# EAGLE design trackuino-simple (EAGLE 6.3)
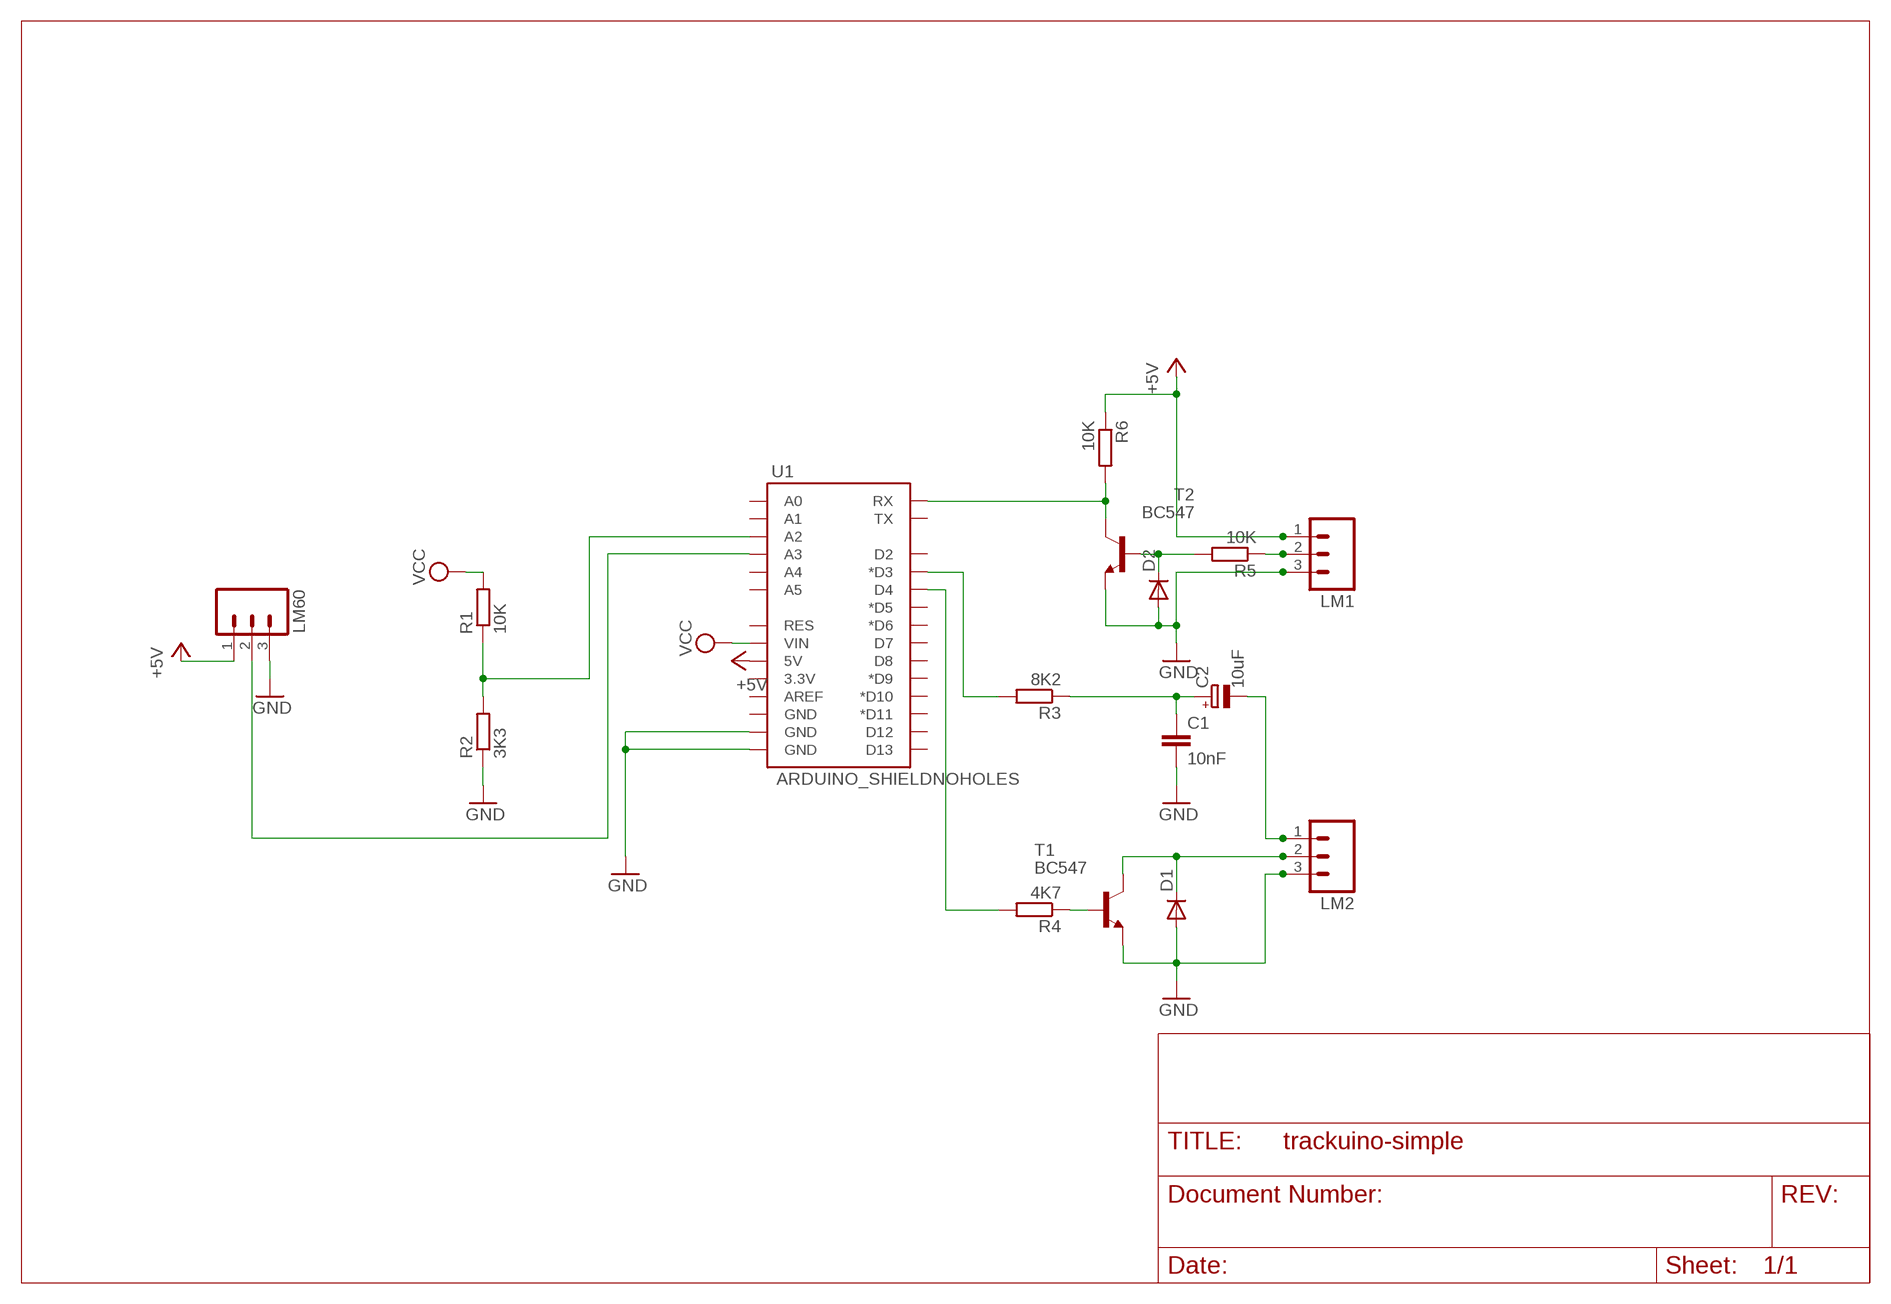
[diagram p0: schematic, sheet 1]

## Parts
C1  10nF  C-EU050-025X075  [C050-025X075]
C2  10uF  CPOL-EUE2.5-6  [E2,5-6]
D1  DIODE-DO41-10  [DO41-10]
D2  DIODE-DO41-10  [DO41-10]
LM1  M03PTH  [1X03]
LM2  M03PTH  [1X03]
LM60  M03PTH  [1X03]
R1  10K  R-EU_0207/10  [0207/10]
R2  3K3  R-EU_0207/10  [0207/10]
R3  8K2  R-EU_0207/10  [0207/10]
R4  4K7  R-EU_0207/10  [0207/10]
R5  10K  R-EU_0207/10  [0207/10]
R6  10K  R-EU_0207/10  [0207/10]
T1  BC547  [TO92]
T2  BC547  [TO92]
U1  ARDUINO_SHIELDNOHOLES  [DUEMILANOVE_SHIELD_NOHOLES]

## Nets
+5V: LM1.1 LM60.1 R6.1 U1.5V
A0: R1.1 R2.2 U1.A2
GND: C1.2 D1.A D2.A LM1.3 LM2.3 LM60.3 R2.1 T1.1(E) T2.1(E) U1.GND@0(GND) U1.GND@1(GND)
N$1: R6.2 T2.3(C) U1.RX
N$2: LM60.2 U1.A3
N$3: R4.2 U1.D4
N$4: R4.1 T1.2(B)
N$5: D2.C R5.2 T2.2(B)
N$6: R3.2 U1.D3(*D3)
N$7: D1.C LM2.2 T1.3(C)
N$8: C1.1 C2.+ R3.1
N$9: C2.- LM2.1
N$10: LM1.2 R5.1
VCC: R1.2 U1.VIN
Unconnected: U1.3.3V U1.A0 U1.A1 U1.A4 U1.A5 U1.AREF U1.D2 U1.D5(*D5) U1.D6(*D6) U1.D7 U1.D8 U1.D9(*D9) U1.D10(*D10) U1.D11(*D11) U1.D12 U1.D13 U1.GND@2(GND) U1.RES U1.TX

## Library data of the parts
C1 = resistor:C-EU: CAPACITOR, European symbol
C2 = resistor:CPOL-EU: POLARIZED CAPACITOR, European symbol
D1 D2 = diode:DIODE-: DIODE
LM1 LM2 LM60 = SparkFun:M03: Header 3 Standard 3-pin 0.1" header. Use with straight break away headers (SKU : PRT-00116), right angle break away headers (PRT-00553), swiss pins (PRT-00743), machine pins (PRT-00117), and female headers (PRT-00115). Molex polarized connector foot print use with SKU : PRT-08232 with associated crimp pins and housings.
R1-R4 = rcl:R-EU_: RESISTOR, European symbol
R5 R6 = resistor:R-EU_: RESISTOR, European symbol
T1 T2 = transistor:BC547: NPN TRANSISTOR
U1 = SparkFun:ARDUINO_SHIELD

## Net classes
0 10: width 0.254 mm
1 15: width 0.381 mm
2 20: width 0.508 mm
3 30: width 0.762 mm
4 40: width 1.016 mm
5 50: width 1.27 mm
6 HIGH Current: width 2.54 mm

## Board
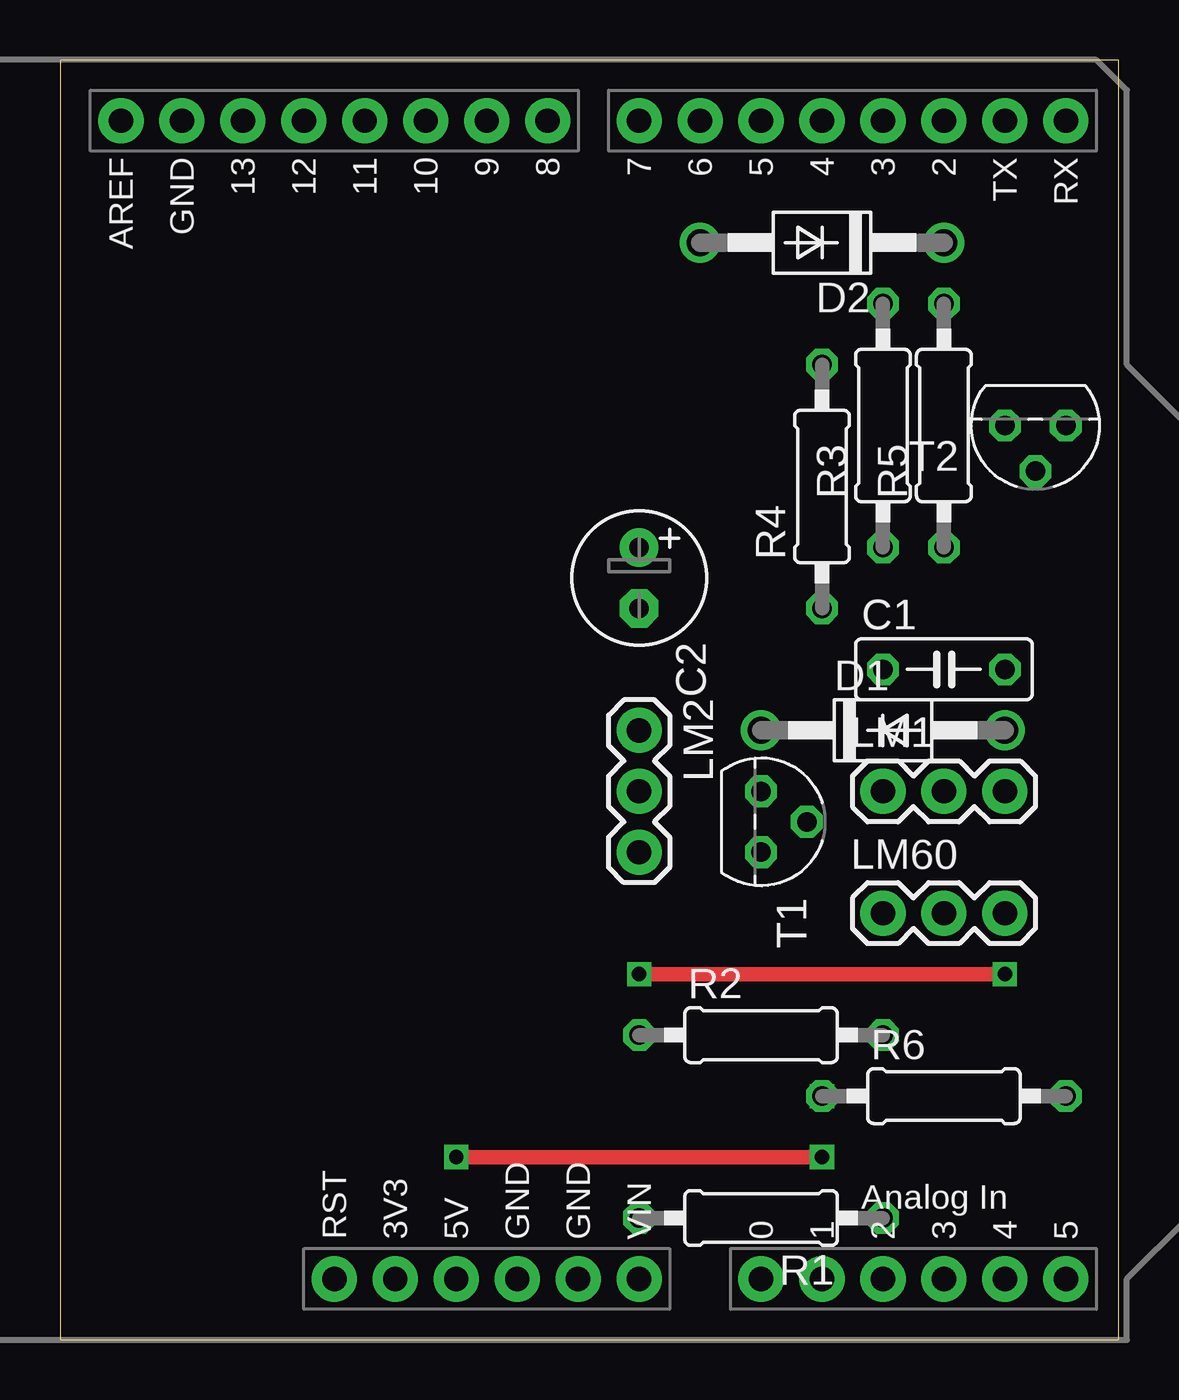
[diagram p1: board, top side]
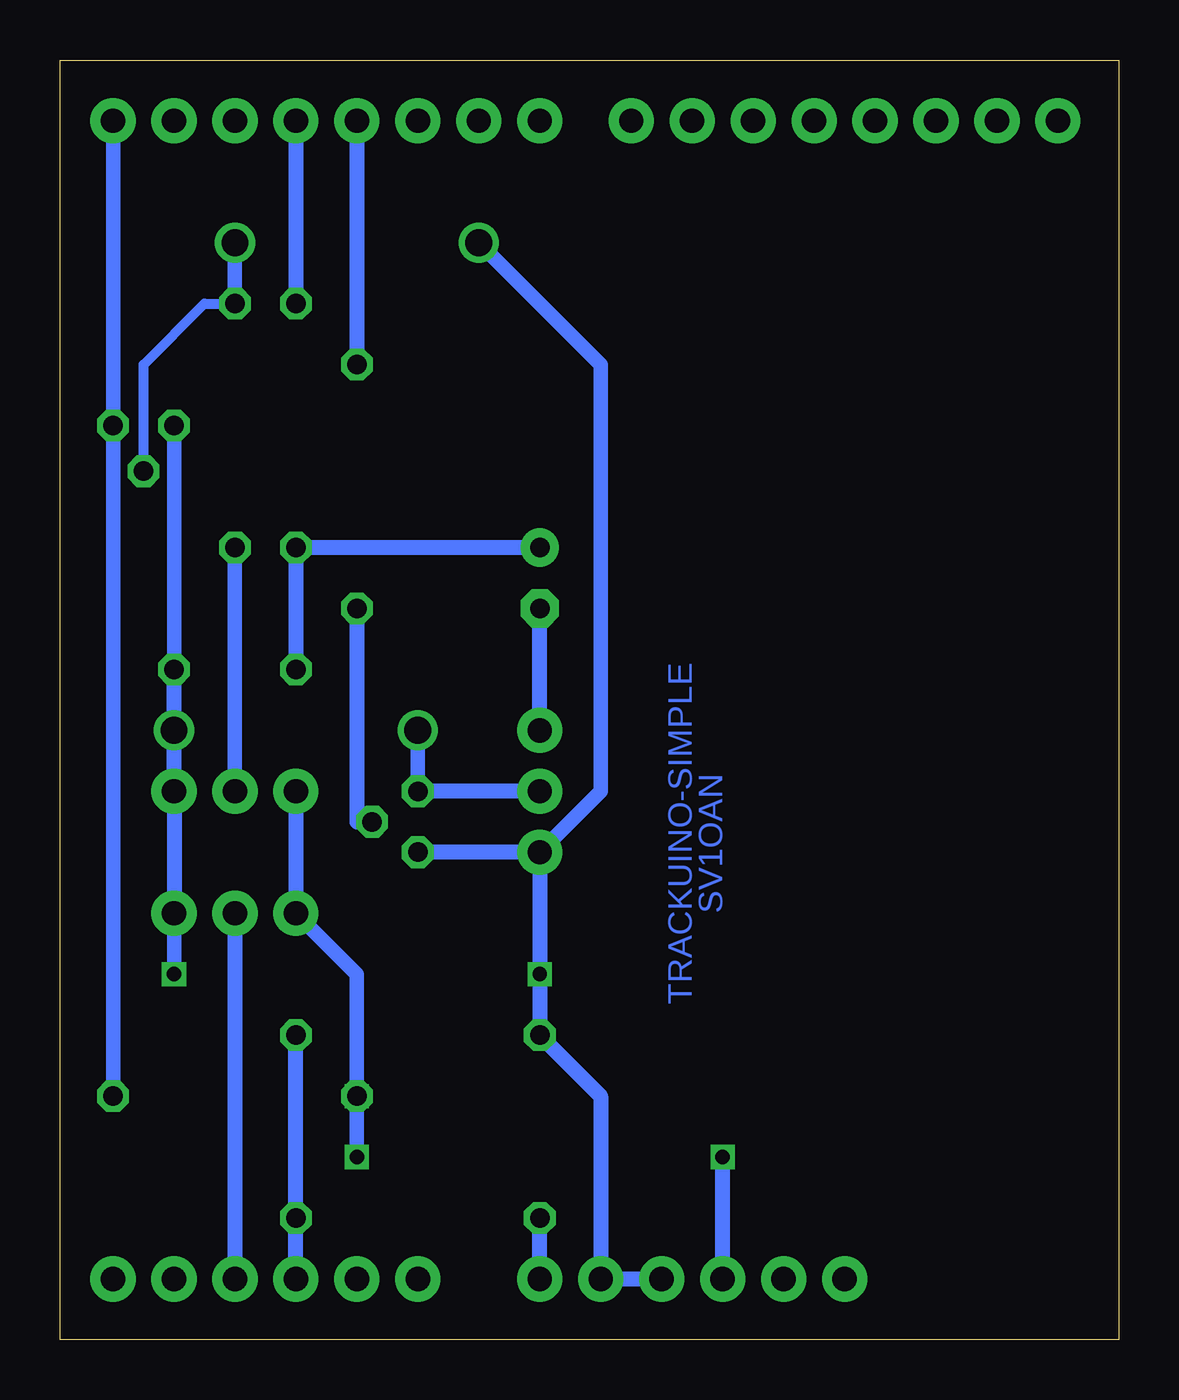
[diagram p2: board, bottom side, seen from below]

Size 44.12 x 53.33 mm. Coordinates in mm from the lower left corner, seen from the top.
Outline: 0,0 44.12,0 44.12,53.33 0,53.33 0,0
Copper layers (1*16): Top 0.035mm / dielectric 1.5mm / Bottom 0.035mm
Design rules "default *": minimum track width 25mil, minimum drill 24mil, track to track 30mil, track to pad 30mil, pad to pad 8mil, via to via 8mil, smd to smd 8mil, copper to edge 20mil, drill to drill 8mil, minimum pad ring 10mil, minimum via ring 8mil, stop-mask expansion 4mil, vias tented up to drill 0mil, thermal gap 10mil

### Footprints (pad centres in the part's own frame; a part is rotated, then mirrored left to right if it is on the bottom)
C050-025X075 = drill 0.813 octagon: 1 -2.54,0; 2 2.54,0
E2,5-6 = drill 0.813 pad 1.6: + -1.27,0 | drill 0.813 pad 1.6 octagon: - 1.27,0
DO41-10 = drill 1.118: A 5.08,0; C -5.08,0
1X03 = drill 1.016 pad 1.88: 1 0,0; 2 2.54,0; 3 5.08,0
0207/10 = drill 0.813 octagon: 1 -5.08,0; 2 5.08,0
TO92 = drill 0.813 octagon: 1 1.27,0; 2 0,1.905; 3 -1.27,0
DUEMILANOVE_SHIELD_NOHOLES = drill 1.016 pad 1.88: 3.3V 50.8,26.67; 5V 50.8,29.21; A0 50.8,41.91; A1 50.8,44.45; A2 50.8,46.99; A3 50.8,49.53; A4 50.8,52.07; A5 50.8,54.61; AREF 2.54,15.24; D2 2.54,49.53; D3 2.54,46.99; D4 2.54,44.45; D5 2.54,41.91; D6 2.54,39.37; D7 2.54,36.83; D8 2.54,33.02; D9 2.54,30.48; D10 2.54,27.94; D11 2.54,25.4; D12 2.54,22.86; D13 2.54,20.32; GND@0 50.8,31.75; GND@1 50.8,34.29; GND@2 2.54,17.78; RES 50.8,24.13; RX 2.54,54.61; TX 2.54,52.07; VIN 50.8,36.83

### Placement (x,y rotation side)
C1  36.83,27.94 0 top
C2  24.13,31.75 270 top
D1  34.29,25.4 0 top
D2  31.75,45.72 180 top
LM1  34.29,22.86 0 top
LM2  24.13,25.4 270 top
LM60  34.29,17.78 0 top
R1  29.21,5.08 180 top
R2  29.21,12.7 0 top
R3  34.29,38.1 90 top
R4  31.75,35.56 90 top
R5  36.83,38.1 90 top
R6  36.83,10.16 0 top
T1  29.21,21.59 270 top
T2  40.64,38.1 180 top
U1  -12.7,53.34 270 top

### Tracks (layer width: path | path; a pad name or v marks a point on that pad's centre or on a via)
+5V  (via drill 0.6)
  Top 0.61: v16.51,7.62 v31.75,7.62
  Bottom 0.61: v31.75,7.62 R6.1 31.75,15.24 LM60.1
  Bottom 0.635: LM1.1 LM60.1 | U1.5V v16.51,7.62
  other vias: 31.75,10.16
A0
  Bottom 0.635: U1.A2 R1.1 R2.2
GND  (via drill 0.6)
  Top 0.61: v39.37,15.24 v24.13,15.24
  Bottom 0.61: T2.1 C1.2 | LM60.3 v39.37,15.24 | D2.A 21.59,40.64 21.59,22.86 LM2.3
  Bottom 0.635: U1.GND@0 U1.GND@1 21.59,10.16 R2.1 v24.13,15.24 LM2.3 T1.1 | LM60.3 LM1.3 D1.A C1.2
N$1
  Bottom 0.61: U1.RX T2.3 R6.2
N$2
  Bottom 0.635: LM60.2 U1.A3
N$3
  Bottom 0.635: U1.D4 R4.2
N$4
  Bottom 0.635: R4.1 31.75,21.59 T1.2
N$5
  Bottom 0.406: T2.2 40.64,40.64 38.1,43.18 R5.2
  Bottom 0.61: R5.2 D2.C
N$6
  Bottom 0.635: U1.D3 R3.2
N$7
  Bottom 0.61: D1.C T1.3
  Bottom 0.635: LM2.2 T1.3
N$8
  Bottom 0.635: C1.1 R3.1 C2.+
N$9
  Bottom 0.635: LM2.1 C2.-
N$10
  Bottom 0.61: R5.1 LM1.2
VCC
  Bottom 0.635: U1.VIN R1.2

### Text on the board
Bottom: SV1OAN | TRACKUINO-SIMPLE